# Altium schematic sheet CC-S11-V00-Power.SchDoc: CC Power System (VCC, USB to 5V, VBUS, 3V3)
size A3; DrawnBy: Jonn Dillon; DocumentNumber: 12; SheetNumber: 12; SheetTotal: 13; Project: Chassis Controller (Interim) 2020
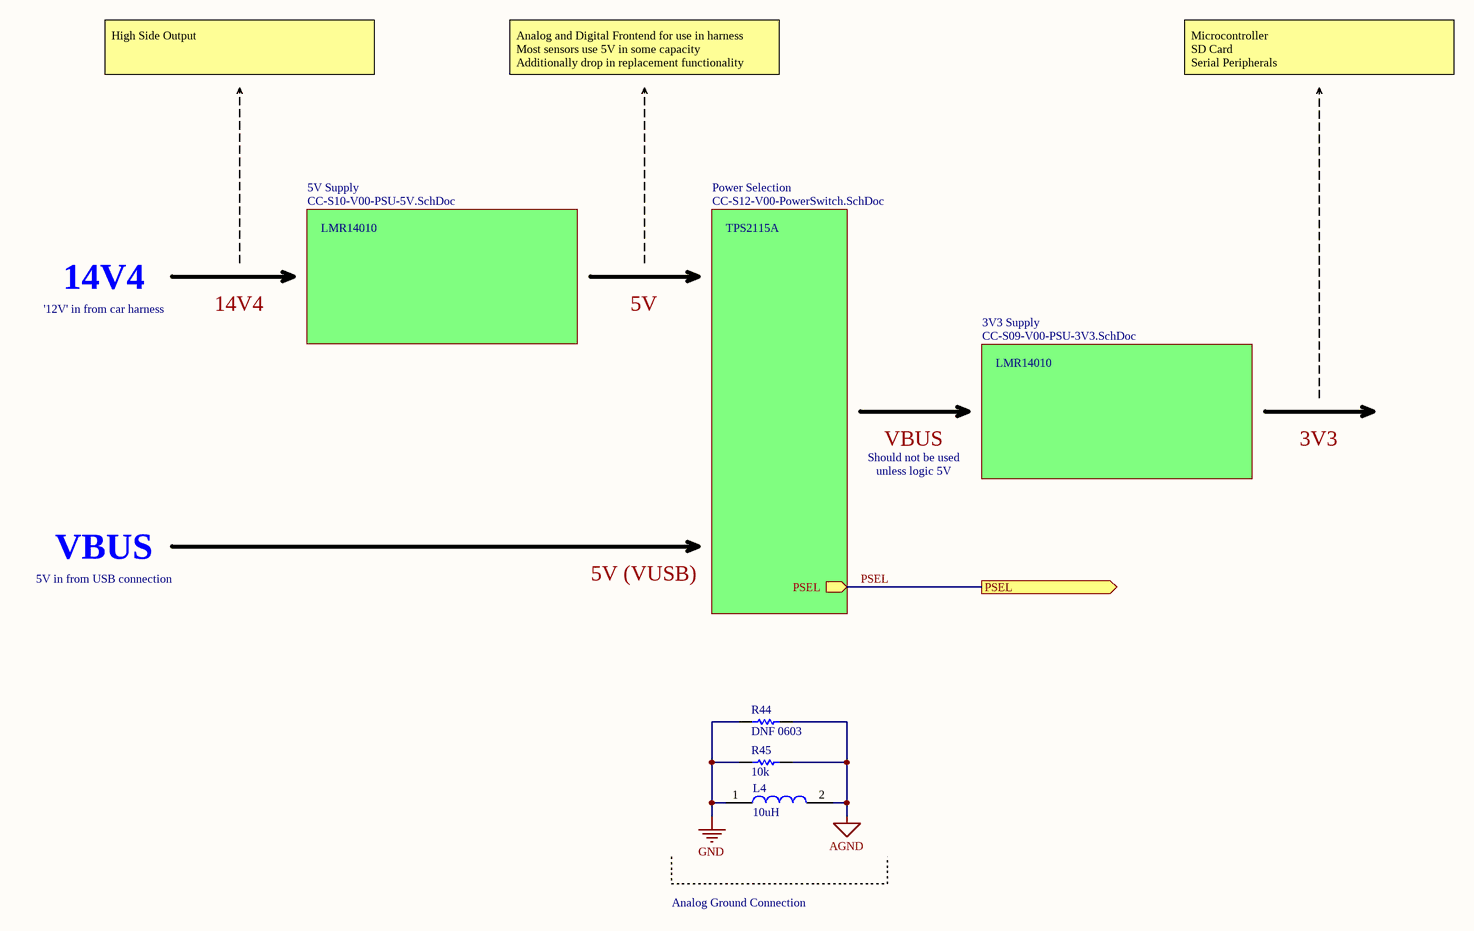
[diagram p0: CC-S11-V00-Power.SchDoc]

## Parts
L4  10uH  [Inductor_0603]
R44  DNF 0603  [Res_ThinFilm_0603]
R45  10k  [Res_ThinFilm_0603]

## Sub-sheets
3V3 Supply = CC-S09-V00-PSU-3V3.SchDoc: no entries
5V Supply = CC-S10-V00-PSU-5V.SchDoc: no entries
Power Selection = CC-S12-V00-PowerSwitch.SchDoc: PSEL (out)

## Ports
PSEL (out)

## Nets
AGND: L4.2 R44.2 R45.2
GND: L4.1 R44.1 R45.1
PSEL: port PSEL, sheet Power Selection/PSEL

## Notes on the sheet
- High Side Output
- Analog and Digital Frontend for use in harness
  Most sensors use 5V in some capacity
  Additionally drop in replacement functionality
- Microcontroller
  SD Card
  Serial Peripherals
- LMR14010
- TPS2115A
- 14V4
- 5V
- '12V' in from car harness
- VBUS
- 3V3
- Should not be used
- unless logic 5V
- 5V (VUSB)
- 5V in from USB connection
- Analog Ground Connection
- Revision History:
- Sheet Title:
- Rev
- Date
- Description
- Project:
- Size:
- Drawn By:
- A3
- Number:
- Revision:
- Sheet
- Version:
- of
- QUT Motorsport
- O-120, Gardens Point
- 2 George Street
- Brisbane, QLD 4000
- Australia
- Print Date:
- Print Time:
- File Name:

## Library data of the parts
L4 = 10uH, 10%, 0603: ComponentLink1Description: Digikey; ComponentLink1URL: https://www.digikey.com.au/product-detail/en/w%C3%BCrth-elektronik/74404064221/732-7261-1-ND/5353241; ComponentLink2Description: LCSC A; ComponentLink2URL: https://lcsc.com/product-detail/Power-Inductors_Sunlord-SWPA6045S221MT_C91047.html; ComponentLink3Description: LCSC B; ComponentLink3URL: https://lcsc.com/product-detail/Power-Inductors_SXN-Shun-Xiang-Nuo-Elec-SMNR6045-221MT_C467145.html
R44 = DNF 0603: Resistor, SMD, DNF, 0.1W, 0603
R45 = 10k 5% 0603: Resistor, SMD, 10k, 0.1W, 5%, 0603